# Altium schematic sheet 0133_WAN_TBT_WiFi_SSD_R.SchDoc
size A3
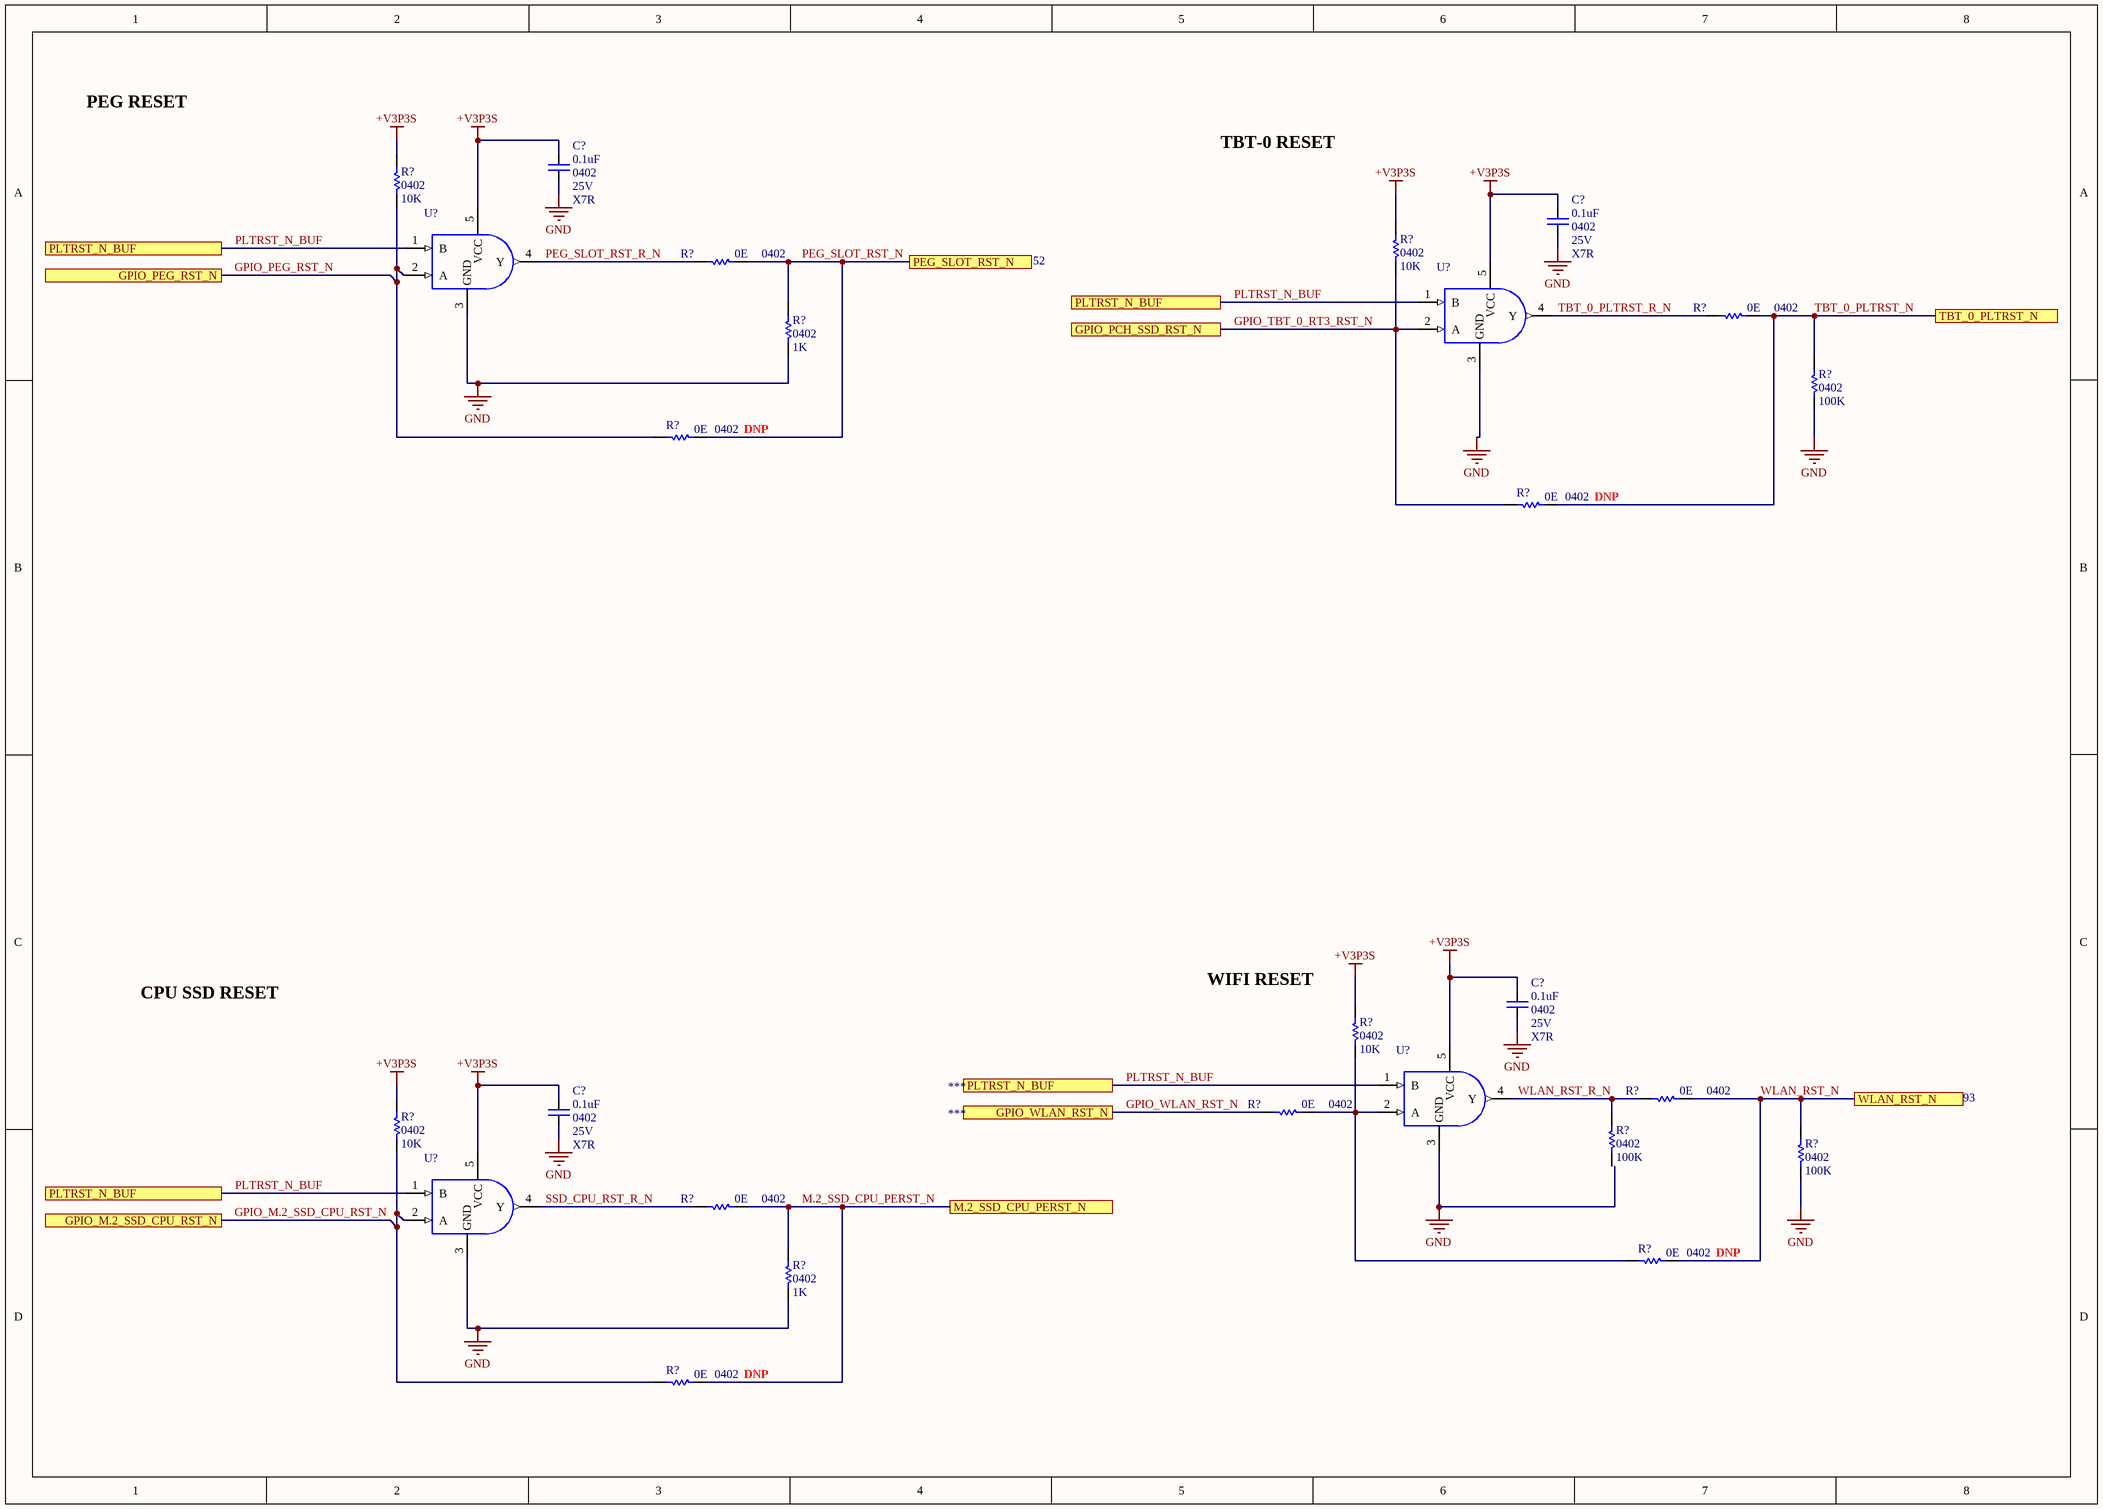
[diagram p0: 0133_WAN_TBT_WiFi_SSD_R.SchDoc]

## Parts
(Parts that share a designator on the sheet are numbered #1, #2 ... from top to bottom, then left to right.)
C?#1  value 0.1uF  Case/Package: 0402  Voltage: 25V  Dielectric: X7R  [CAPC0402]
C?#2  value 0.1uF  Case/Package: 0402  Voltage: 25V  Dielectric: X7R  [CAPC0402]
C?#3  value 0.1uF  Case/Package: 0402  Voltage: 25V  Dielectric: X7R  [CAPC0402]
C?#4  value 0.1uF  Case/Package: 0402  Voltage: 25V  Dielectric: X7R  [CAPC0402]
R?#1  value 10K  Case/Package: 0402  [RESC0402]  (hidden comment: Res)
R?#2  value 10K  Case/Package: 0402  [RESC0402]  (hidden comment: Res)
R?#3  value 0E  Case/Package: 0402  [RESC0402]  (hidden comment: Res)
R?#4  value 0E  Case/Package: 0402  [RESC0402]  (hidden comment: Res)
R?#5  value 1K  Case/Package: 0402  [RESC0402]  (hidden comment: Res)
R?#6  value 100K  Case/Package: 0402  [RESC0402]  (hidden comment: Res)
R?#7  value 0E  Case/Package: 0402  [RESC0402]  (hidden comment: Res)
R?#8  value 0E  Case/Package: 0402  [RESC0402]  (hidden comment: Res)
R?#9  value 10K  Case/Package: 0402  [RESC0402]  (hidden comment: Res)
R?#10  value 0E  Case/Package: 0402  [RESC0402]  (hidden comment: Res)
R?#11  value 0E  Case/Package: 0402  [RESC0402]  (hidden comment: Res)
R?#12  value 10K  Case/Package: 0402  [RESC0402]  (hidden comment: Res)
R?#13  value 100K  Case/Package: 0402  [RESC0402]  (hidden comment: Res)
R?#14  value 100K  Case/Package: 0402  [RESC0402]  (hidden comment: Res)
R?#15  value 0E  Case/Package: 0402  [RESC0402]  (hidden comment: Res)
R?#16  value 0E  Case/Package: 0402  [RESC0402]  (hidden comment: Res)
R?#17  value 1K  Case/Package: 0402  [RESC0402]  (hidden comment: Res)
R?#18  value 0E  Case/Package: 0402  [RESC0402]  (hidden comment: Res)
U?#1  74AHC1G08GW,125  [SOT353]  (value not drawn)
U?#2  74AHC1G08GW,125  [SOT353]  (value not drawn)
U?#3  74AHC1G08GW,125  [SOT353]  (value not drawn)
U?#4  74AHC1G08GW,125  [SOT353]  (value not drawn)

## Ports
GPIO_M.2_SSD_CPU_RST_N, GPIO_PCH_SSD_RST_N, GPIO_PEG_RST_N, GPIO_WLAN_RST_N, M.2_SSD_CPU_PERST_N, PEG_SLOT_RST_N, PLTRST_N_BUF, TBT_0_PLTRST_N, WLAN_RST_N

## Nets
+V3P3S: C?#1.1 C?#2.1 C?#3.1 C?#4.1 R?#1.2 R?#2.2 R?#9.2 R?#12.2 U?#1.5(VCC) U?#2.5(VCC) U?#3.5(VCC) U?#4.5(VCC)
GND: C?#1.2 C?#2.2 C?#3.2 C?#4.2 R?#5.1 R?#6.1 R?#14.1 R?#17.1 U?#1.3(GND) U?#2.3(GND) U?#3.3(GND) U?#4.3(GND)
GPIO_M.2_SSD_CPU_RST_N: R?#12.1 R?#18.1 U?#4.2(A) ; port GPIO_M.2_SSD_CPU_RST_N
GPIO_PEG_RST_N: R?#1.1 R?#7.1 U?#1.2(A) ; port GPIO_PEG_RST_N
GPIO_TBT_0_RT3_RST_N: R?#2.1 R?#8.1 U?#2.2(A) ; port GPIO_PCH_SSD_RST_N
GPIO_WLAN_RST_N: R?#11.1 ; port GPIO_WLAN_RST_N
M.2_SSD_CPU_PERST_N: R?#15.2 R?#17.2 R?#18.2 ; port M.2_SSD_CPU_PERST_N
PEG_SLOT_RST_N: R?#3.2 R?#5.2 R?#7.2 ; port PEG_SLOT_RST_N
PEG_SLOT_RST_R_N: R?#3.1 U?#1.4(Y)
PLTRST_N_BUF: U?#1.1(B) U?#2.1(B) U?#3.1(B) U?#4.1(B) ; port PLTRST_N_BUF
SSD_CPU_RST_R_N: R?#15.1 U?#4.4(Y)
TBT_0_PLTRST_N: R?#4.2 R?#6.2 R?#8.2 ; port TBT_0_PLTRST_N
TBT_0_PLTRST_R_N: R?#4.1 U?#2.4(Y)
WLAN_RST_N: R?#10.2 R?#14.2 R?#16.2 ; port WLAN_RST_N
WLAN_RST_R_N: R?#10.1 R?#13.2 U?#3.4(Y)
NetR?#9_1: R?#9.1 R?#11.2 R?#16.1 U?#3.2(A)

Not connected (* = marked no-connect by the designer): R?#13 1

## Notes on the sheet
- PEG RESET
- TBT-0 RESET
- WIFI RESET
- CPU SSD RESET

## Library data of the parts
C?#1-C?#4 = Cap: CAP CER 0.1uF 25V X7R 0402
R?#1 R?#2 R?#9 R?#12 = Res: Thick Film Resistor -  10Kohm, 1%, 0402
R?#3 R?#4 R?#7 R?#8 R?#10 R?#11 R?#15 R?#16 R?#18 = Res: Thick Film Resistor -  0ohm, 1%, 0402
  R?#7 R?#8 R?#16 R?#18: DNP: DNP
R?#5 R?#17 = Res: Thick Film Resistor -  1Kohm, 1%, 0402
R?#6 R?#13 R?#14 = Res: Thick Film Resistor -  100Kohm, 1%, 0402
U?#1-U?#4 = 74AHC1G08GW,125: Logic IC - Gate NXP Semiconductors 74AHC1G08GW, 125 AND gate 74AHC TSSOP 5; Manufacturer: Nexperia; Supplier 1: Digi-Key; Manufacturer Part Number: 74AHC1G08GW,125; Stock 1: 41783; Pricing 1: 1=0.27, 10=0.223, 25=0.1872, 100=0.1184, 250=0.0914, 500=0.0779, 1000=0.053 (USD); Case/Package: SOT-353; Supplier Part Number 1: 1727-3148-1-ND